# EAGLE design balloon_sensor_board (EAGLE 7.7.0)
Assembly variants: POR

## Sheet 1 of 3: TITLE_TOC
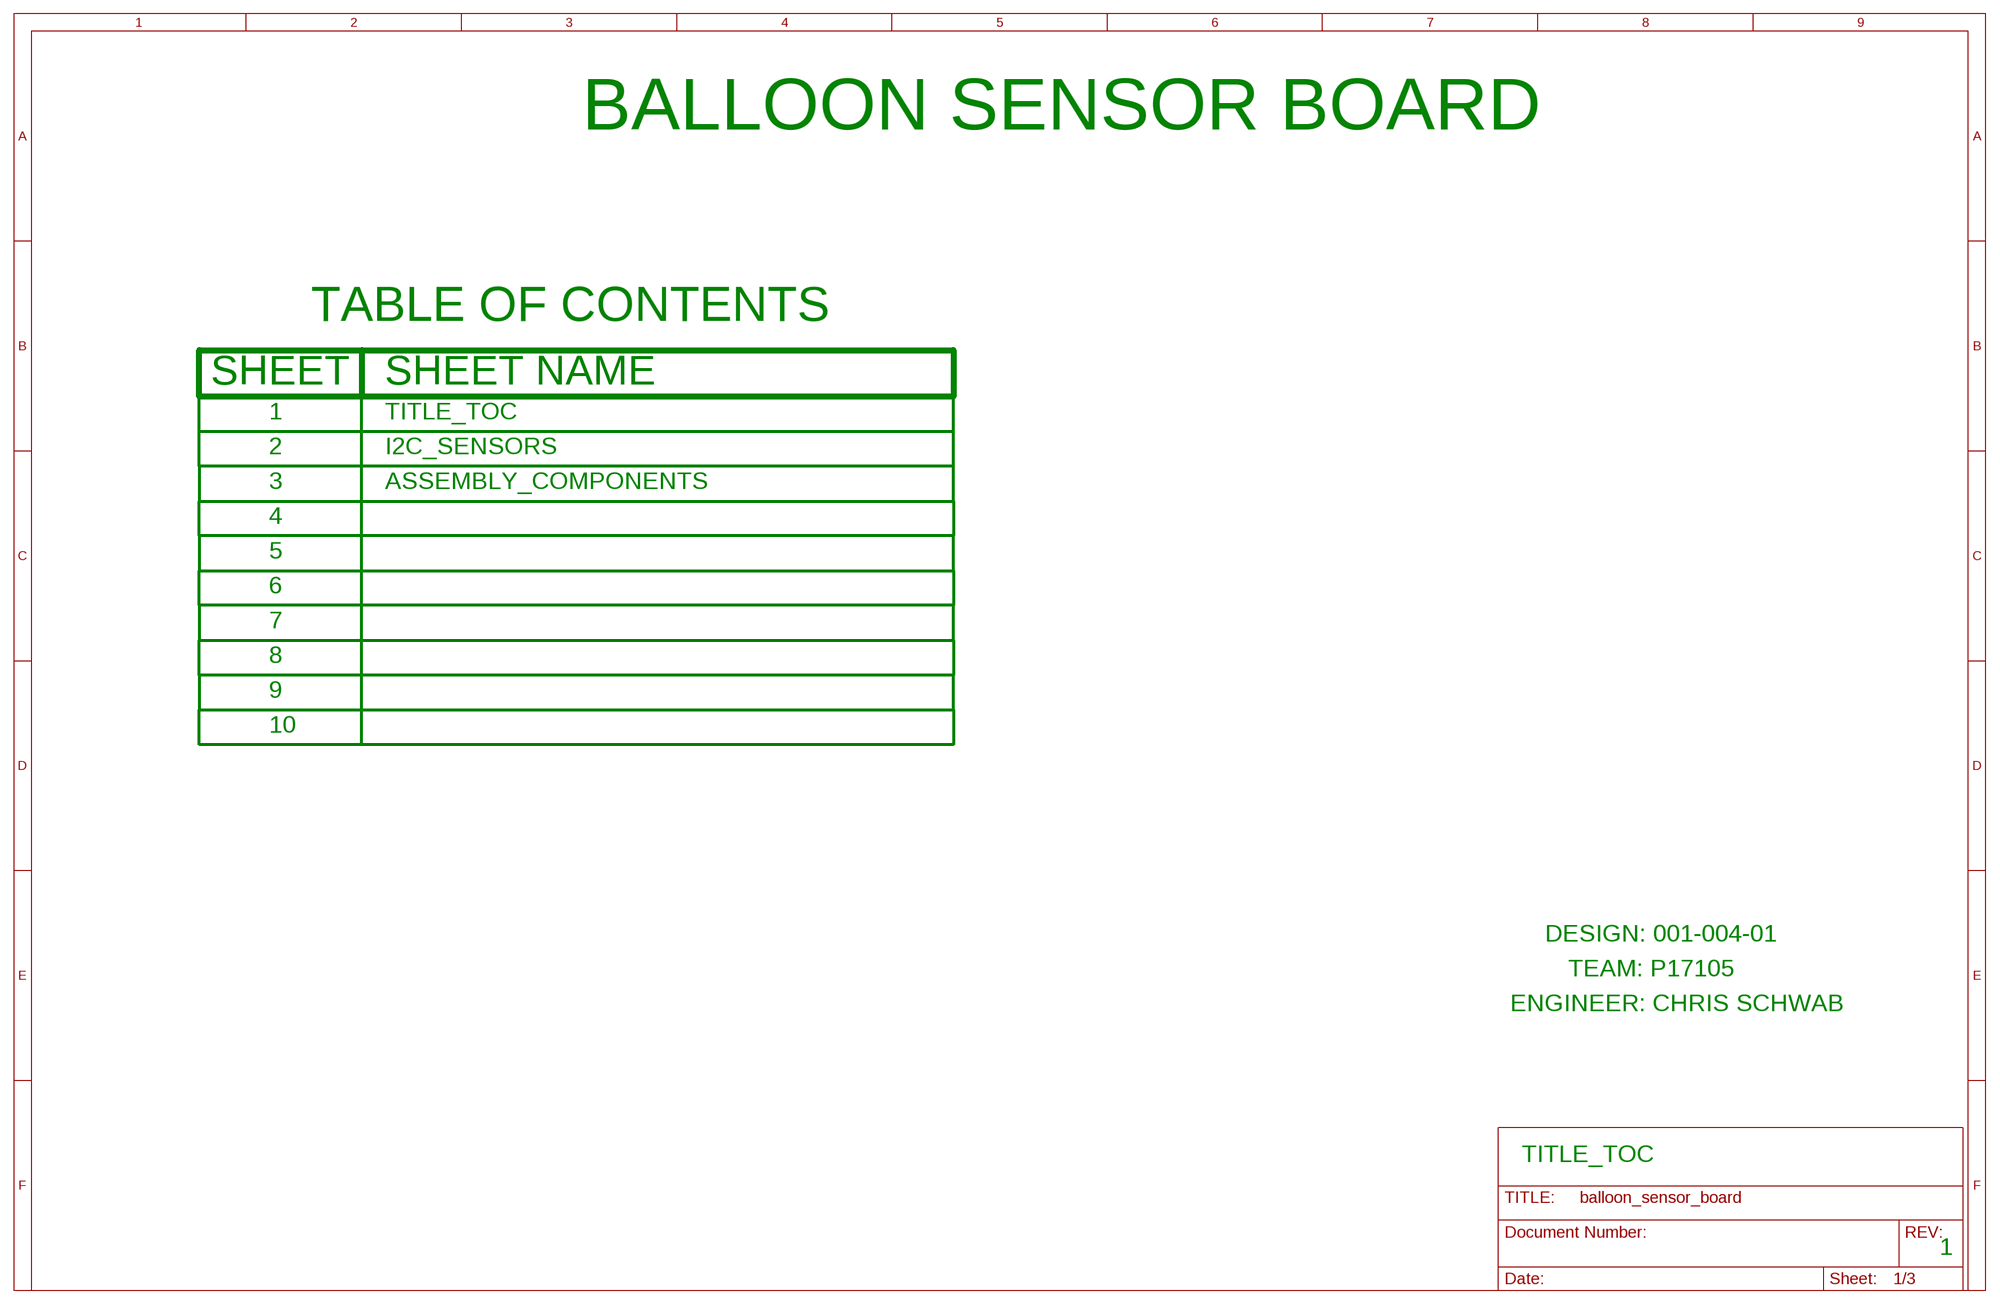
[diagram p0: schematic, sheet 1]

### Notes on the sheet
- BALLOON SENSOR BOARD
- TITLE_TOC
- I2C_SENSORS
- ASSEMBLY_COMPONENTS
- DESIGN: 001-004-01
- TEAM: P17105
- ENGINEER: CHRIS SCHWAB
- TITLE_TOC
- 1

## Sheet 2 of 3: I2C_SENSORS
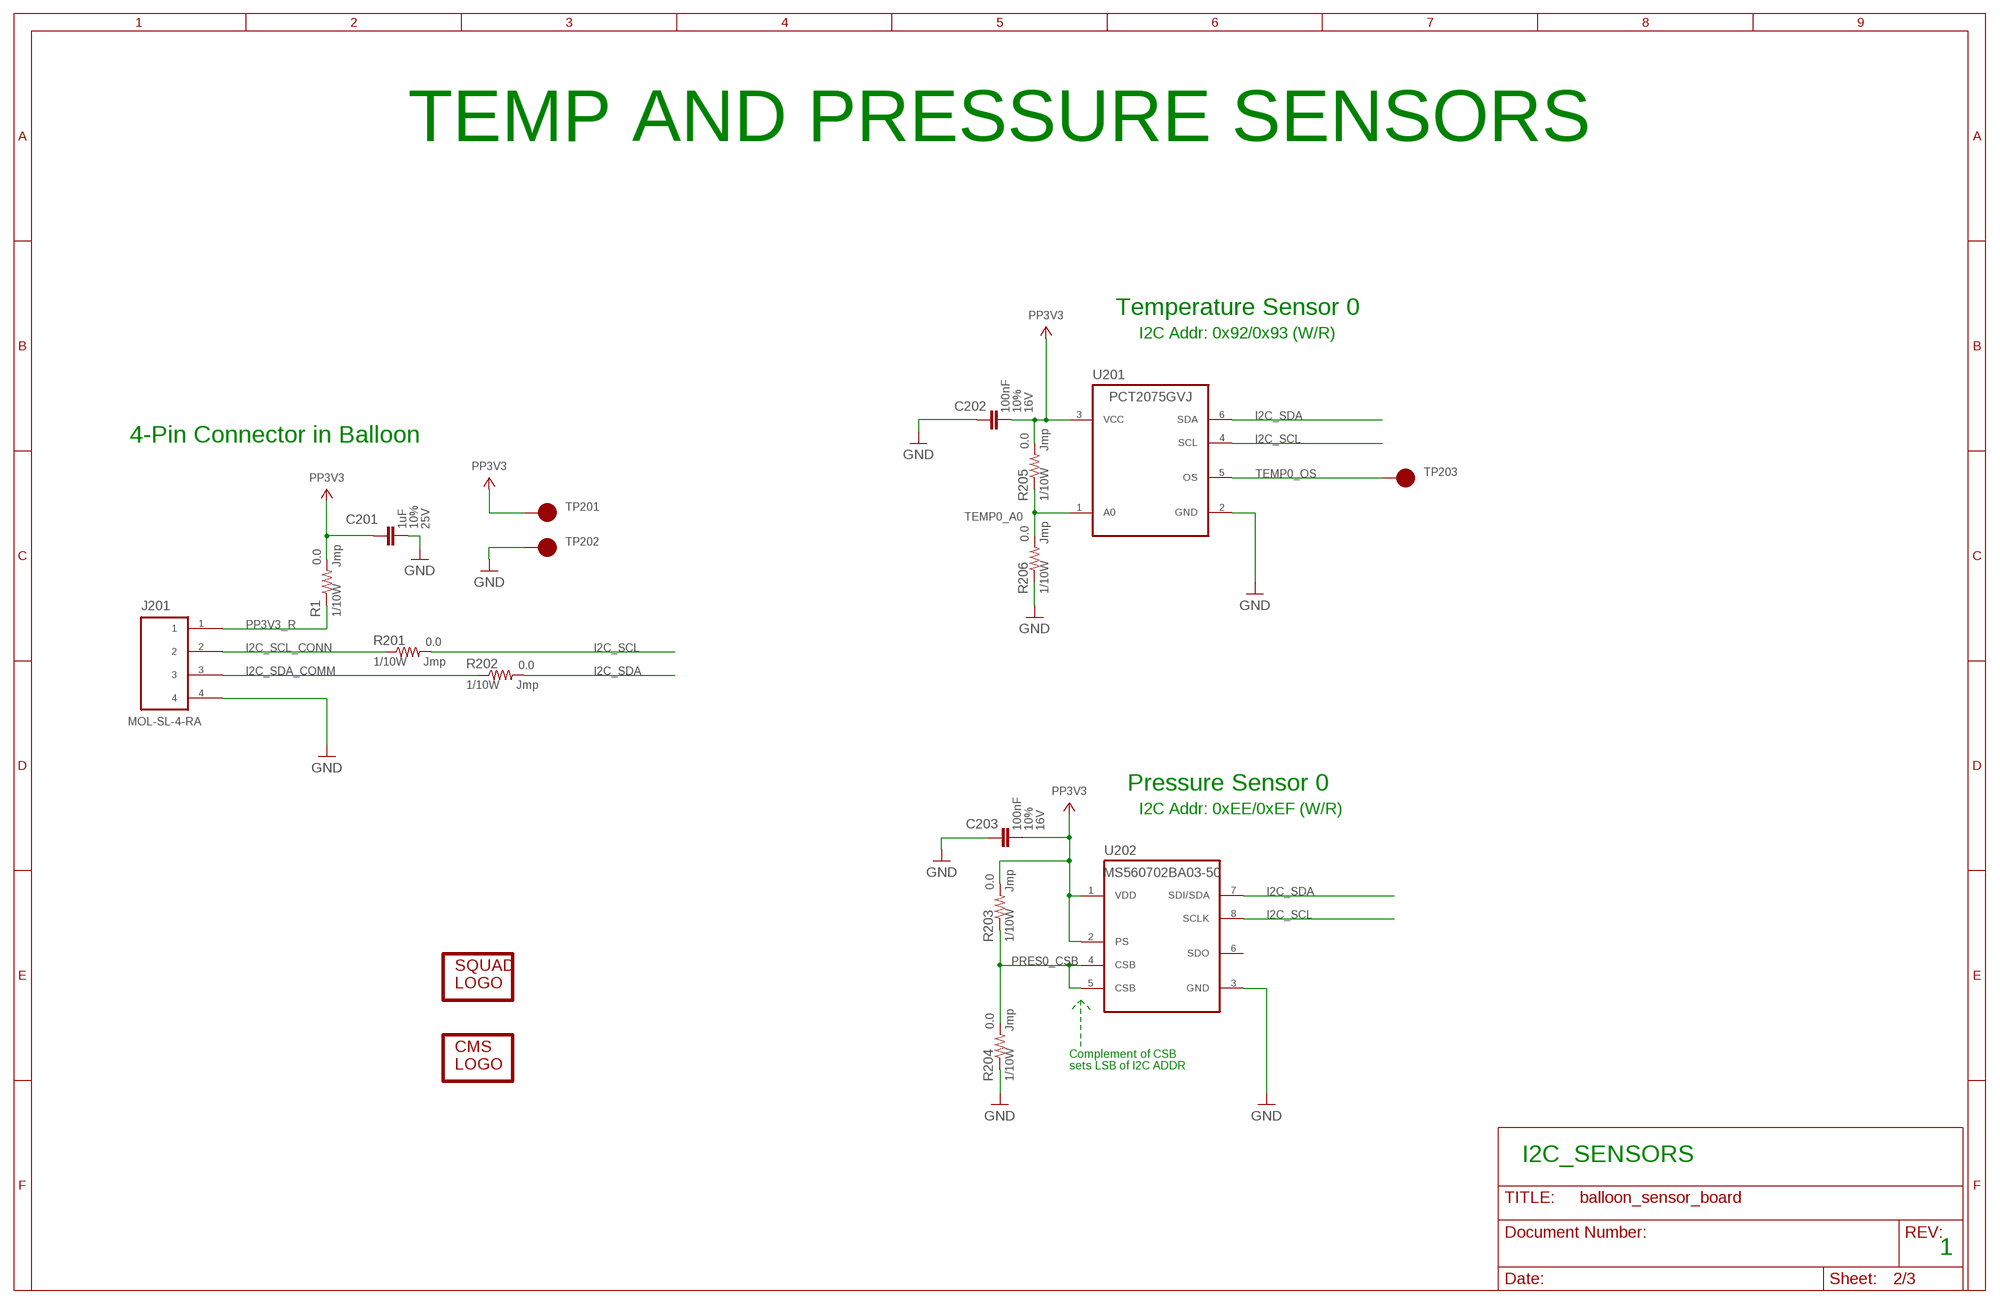
[diagram p1: schematic, sheet 2]

### Parts
C201  1uF  CAP_1UF0_0603  [C0603]
C202  100nF  CAP_100NF0_0603  [C0603]
C203  100nF  CAP_100NF0_0603  [C0603]
J201  MOL-SL-4-RA  MOLSL_4PIN_SL4RA_RA  [MOLSL-4-RA]
LOGO201  SQUAD_LOGO  [SQUAD_LOGO]
LOGO202  CMS_LOGO  [CMS_LOGO]
R1  0.0  RES_0R0_0603  [R0603]
R201  0.0  RES_0R0_0603  [R0603]
R202  0.0  RES_0R0_0603  [R0603]
R203  0.0  RES_0R0_0603  [R0603]  (not fitted in variant POR)
R204  0.0  RES_0R0_0603  [R0603]
R205  0.0  RES_0R0_0603  [R0603]  (not fitted in variant POR)
R206  0.0  RES_0R0_0603  [R0603]
TP201  TEST_POINT_SMT_15R_SMD  [TP15R]
TP202  TEST_POINT_SMT_15R_SMD  [TP15R]
TP203  TEST_POINT_SMT_15R_SMD  [TP15R]
U201  PCT2075GVJ  PCT2075GV_TSOP6  [TSOP95P080X055-6N]
U202  MS560702BA03-50  MS5607-02BA03_8SMD  [SMD125P110X060-8N]

### Nets
GND: C201.2 C202.1 C203.1 J201.4 R204.1 R206.1 TP202.TP U201.2(GND) U202.3(GND)
I2C_SCL: R201.2 U201.4(SCL) U202.8(SCLK)
I2C_SCL_CONN: J201.2 R201.1
I2C_SDA: R202.2 U201.6(SDA) U202.7(SDI/SDA)
I2C_SDA_COMM: J201.3 R202.1
PP3V3: C201.1 C202.2 C203.2 R1.2 R203.2 R205.2 TP201.TP U201.3(VCC) U202.1(VDD) U202.2(PS)
PP3V3_R: J201.1 R1.1
PRES0_CSB: R203.1 R204.2 U202.4(CSB) U202.5(CSB)
TEMP0_A0: R205.1 R206.2 U201.1(A0)
TEMP0_OS: TP203.TP U201.5(OS)
Unconnected: U202.6(SDO)

### Notes on the sheet
- TEMP AND PRESSURE SENSORS
- Temperature Sensor 0
- I2C Addr: 0x92/0x93 (W/R)
- 4-Pin Connector in Balloon
- Pressure Sensor 0
- I2C Addr: 0xEE/0xEF (W/R)
- Complement of CSB
- sets LSB of I2C ADDR
- I2C_SENSORS
- 1

## Sheet 3 of 3: ASSEMBLY_COMPONENTS
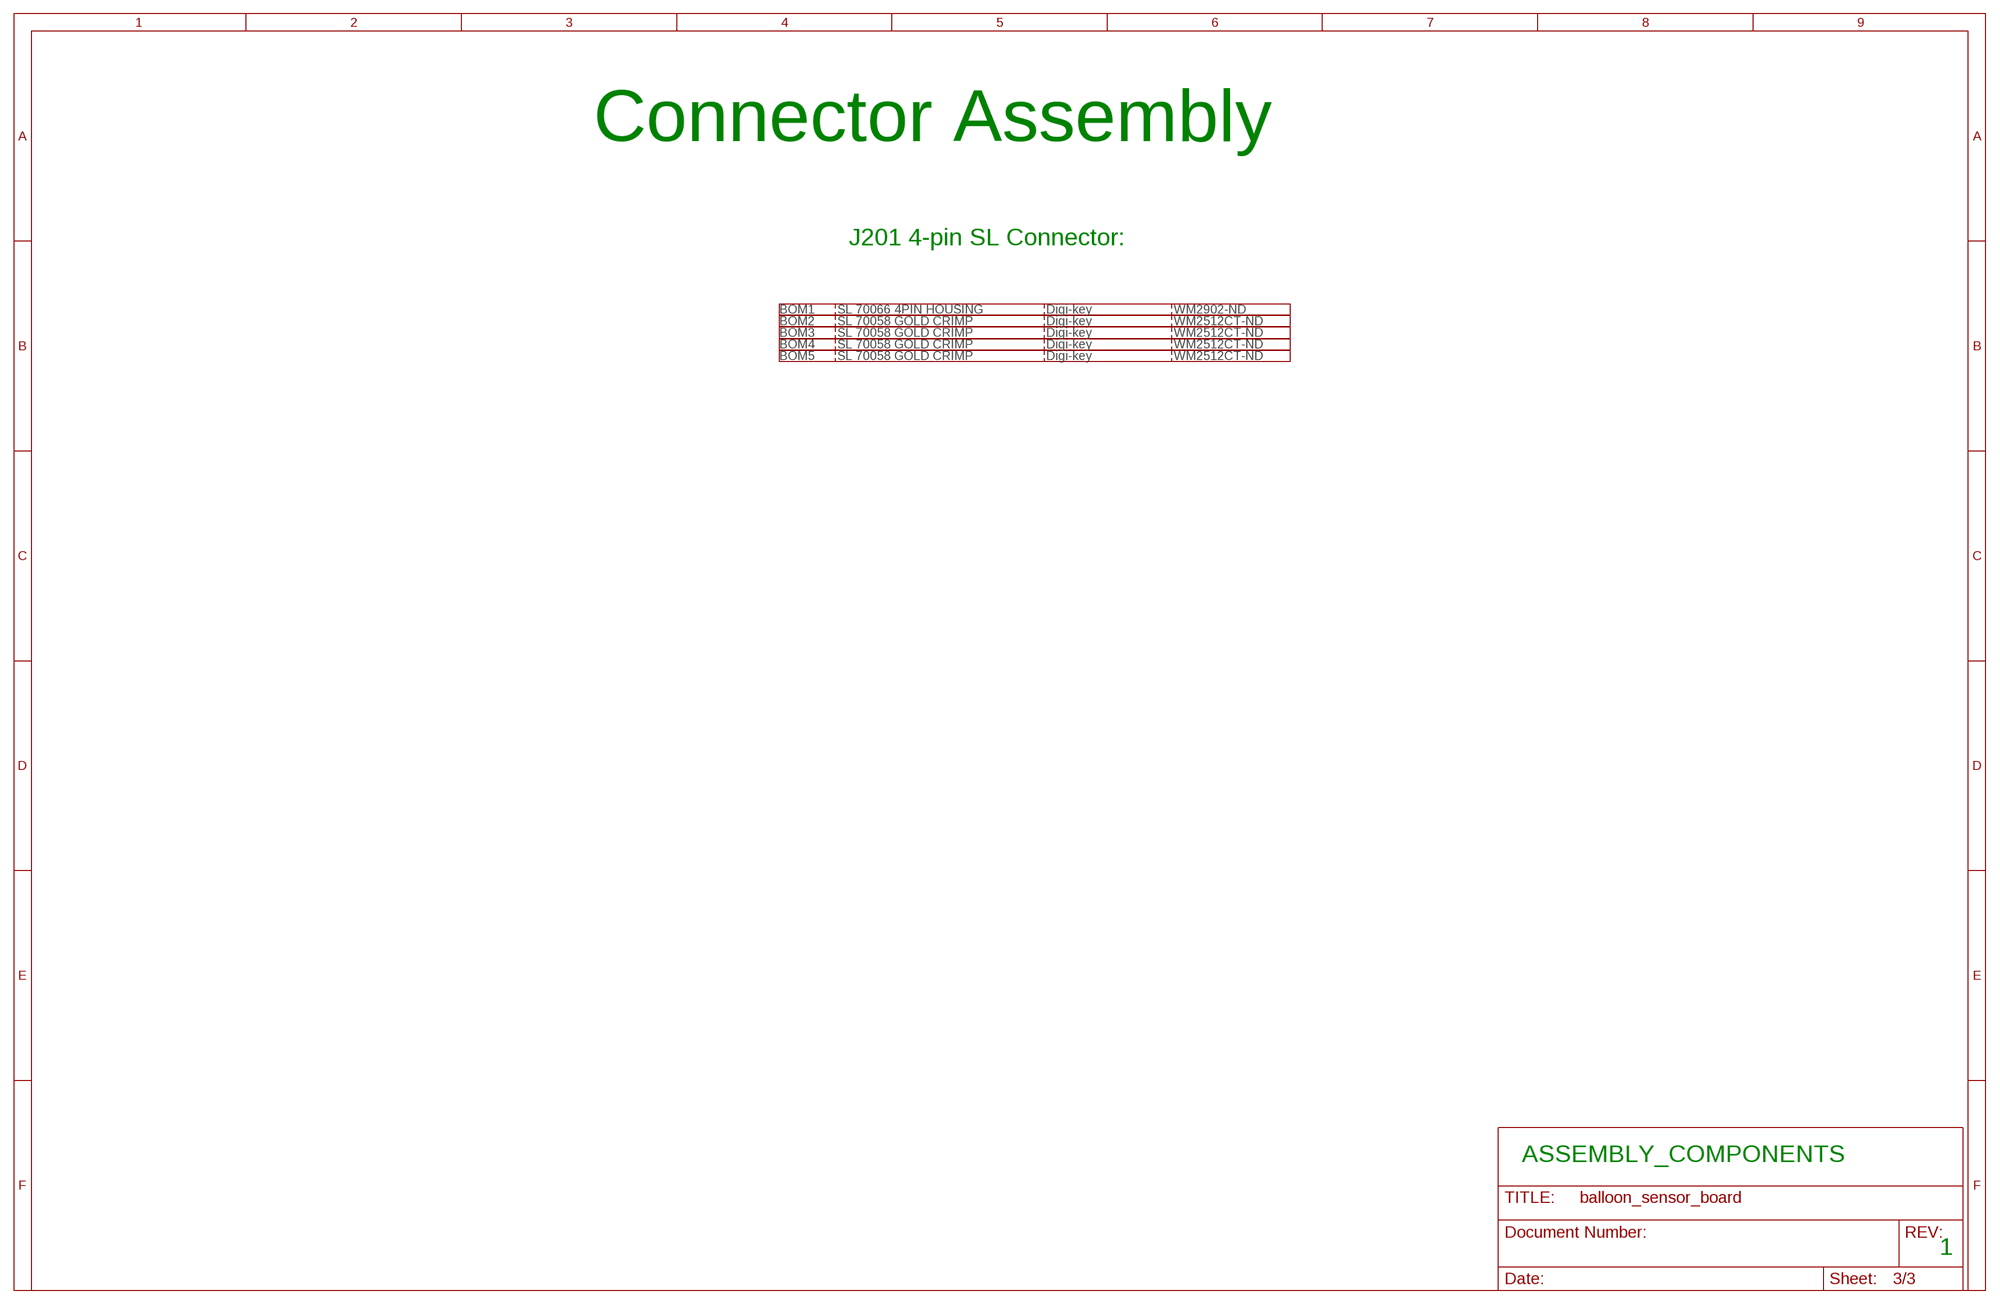
[diagram p2: schematic, sheet 3]

### Parts
BOM1  SL 70066 4PIN HOUSING  BOM_LINE_ITEM_BLI4  [BLANK]
BOM2  SL 70058 GOLD CRIMP  BOM_LINE_ITEM_BLI6  [BLANK]
BOM3  SL 70058 GOLD CRIMP  BOM_LINE_ITEM_BLI6  [BLANK]
BOM4  SL 70058 GOLD CRIMP  BOM_LINE_ITEM_BLI6  [BLANK]
BOM5  SL 70058 GOLD CRIMP  BOM_LINE_ITEM_BLI6  [BLANK]

### Notes on the sheet
- Connector Assembly
- J201 4-pin SL Connector:
- ASSEMBLY_COMPONENTS
- 1

## Library data of the parts
BOM1 = daqcs:BOM_LINE_ITEM; DATASHEET: HW/docs/projects/raspi_zero_power_sensor_hat/datasheets/connectors/uart_1wire_power_battery/050579402_sd.pdf; MANUFACTURER: Molex; MANUFACTURER_PN: 0050579404; VENDOR: Digi-key; VENDOR_PN: WM2902-ND
BOM2-BOM5 = daqcs:BOM_LINE_ITEM; DATASHEET: HW/docs/projects/raspi_zero_power_sensor_hat/datasheets/connectors/uart_1wire_power_battery/016020087_sd.pdf; MANUFACTURER: Molex; MANUFACTURER_PN: 0016020087; VENDOR: Digi-key; VENDOR_PN: WM2512CT-ND
C201 = daqcs:CAP: Chip Capacitor; DATASHEET: HW/docs/projects/raspi_zero_power_sensor_hat/datasheets/passives/c02e.pdf; MANUFACTURER: Murata; MANUFACTURER_PN: GRM188R61E105KA12D; TEMP_COEFF: X5R; TOLERANCE: 10%; VENDOR: Digi-key; VENDOR_PN: 490-3897-1-ND; VOLTAGE: 25V
C202 C203 = daqcs:CAP: Chip Capacitor; DATASHEET: HW/docs/projects/raspi_zero_power_sensor_hat/datasheets/passives/c02e.pdf; MANUFACTURER: Murata; MANUFACTURER_PN: GRM188R71C104KA01D; TEMP_COEFF: X7R; TOLERANCE: 10%; VENDOR: Digi-key; VENDOR_PN: 490-1532-1-ND; VOLTAGE: 16V
J201 = daqcs:MOLSL_4PIN: Molex SL Series 4-Position Connector Wire to board 2.54 mm (.1 inch) pitch header (right-angle or vertical) Housing: Vendor=Molex, Vendor_PN=0050579404 22-24 AWG Crimp: Vendor=Molex, Vendor_PN=0016020087 Wires: AWG,Amps (Max) 22, 3.0 24, 3.0 26, 1.8 28, 1.2; DATASHEET: HW/docs/projects/raspi_zero_power_sensor_hat/datasheets/connectors/uart_1wire_power_battery/705530001_sd.pdf; FINISH: GOLD; LOCKING: YES; MANUFACTURER: Molex; MANUFACTURER_PN: 0705530003; MAX_CURRENT: 3.0A; MOUNT_ANGLE: RIGHT; MOUNT_TYPE: TH; POSITIONS: 4; VENDOR: Digi-key; VENDOR_PN: WM4902-ND
LOGO201 = daqcs:SQUAD_LOGO
LOGO202 = daqcs:CMS_LOGO
R1 R201-R206 = daqcs:RES: Chip Resistor; DATASHEET: HW/docs/projects/raspi_zero_power_sensor_hat/datasheets/passives/AOA0000C281.pdf; MANUFACTURER: Panasonic; MANUFACTURER_PN: ERJ-3GEY0R00V; POWER: 1/10W; RATED_CURRENT: 1.0A; TOLERANCE: Jmp; VENDOR: Digi-key; VENDOR_PN: P0.0GCT-ND
TP201-TP203 = daqcs:TEST_POINT_SMT: Test Point (various sizes)
U201 = daqcs:PCT2075GV: I2C-bus Fm+, 1 degree C accuracy, digital temperature sensor and thermal watchdog; DATASHEET: HW/docs/projects/raspi_zero_power_sensor_hat/datasheets/sensors/PCT2075.pdf; INTERFACE: I2C; MANUFACTURER: NXP; MANUFACTURER_PN: PCT2075GVJ; RESOLUTION: 10b; VENDOR: Digi-key; VENDOR_PN: 568-12424-1-ND
U202 = daqcs:MS5607: Barometric Pressure Sensor, with stainless steel cap Specs High resolution module, 20cm Fast conversion down to 1 ms Low power, 1 μA (standby < 0.15 μA) QFN package 5.0 x 3.0 x 1.0 mm3 Supply voltage 1.8 to 3.6 V Integrated digital pressure sensor (24 bit ΔΣ ADC) Operating range: 10 to 1200 mbar, -40 to +85 °C I2C and SPI interface up to 20 MHz No external components (Internal oscillator) Excellent long term stability; DATASHEET: HW/docs/projects/raspi_zero_power_sensor_hat/datasheets/sensors/ENG_DS_MS5607-02BA03_B.pdf; INTERFACE: I2C,SPI; MANUFACTURER: TE Connectivity; MANUFACTURER_PN: MS560702BA03-50; OUTPUT_BITS: 24b; PRESSURE_TYPE: Absolute; VENDOR: Digi-key; VENDOR_PN: 223-1198-1-ND

## Net classes
0 default: drill 0.381 mm, clearance 0.152 mm

## Board
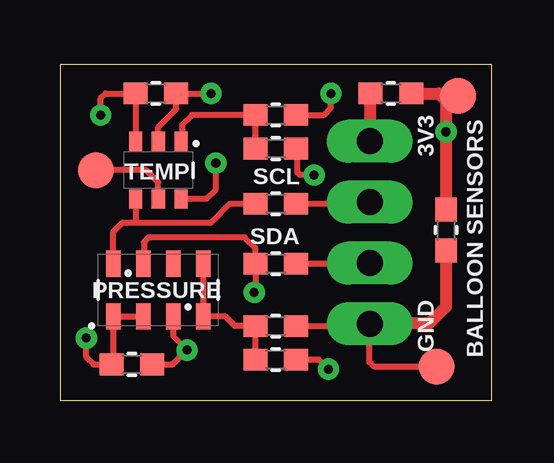
[diagram p3: board, top side]
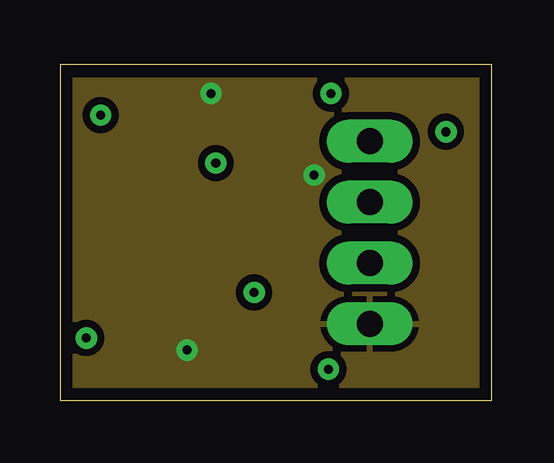
[diagram p4: board, inner layer GND]
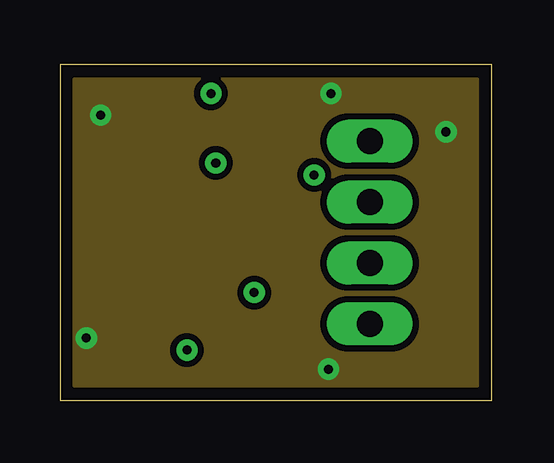
[diagram p5: board, inner layer PWR]
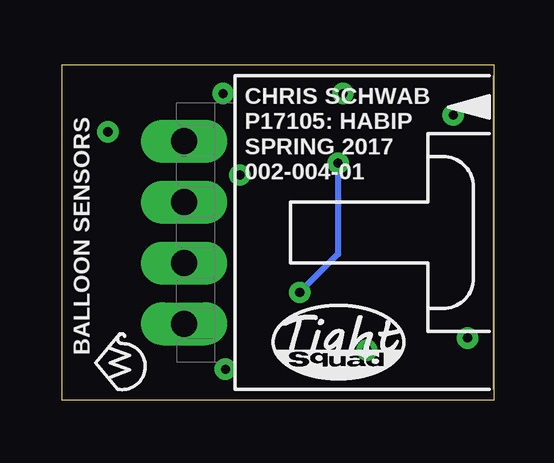
[diagram p6: board, bottom side, seen from below]

Size 18 x 14 mm. Coordinates in mm from the lower left corner, seen from the top.
Outline: 0,0 18,0 18,14 0,14 0,0
Copper layers (1+2*15+16): Top 0.035mm / dielectric 0.486mm / GND 0.035mm / dielectric 0.488mm / PWR 0.035mm / dielectric 0.486mm / Bottom 0.035mm
Design rules "4layer_4pcb": minimum track width 6mil, minimum drill 15mil, track to track 6mil, track to pad 6mil, pad to pad 6mil, via to via 6mil, smd to smd 6mil, copper to edge 20mil, drill to drill 10mil, minimum pad ring 14mil, minimum via ring 10mil, stop-mask expansion 2.5mil, vias tented up to drill 16mil, thermal gap 10mil

### Footprints (pad centres in the part's own frame; a part is rotated, then mirrored left to right if it is on the bottom)
C0603 = smd 1 x 0.9: 1 -0.85,0; 2 0.85,0
MOLSL-4-RA = drill 1.09 long: 1 -3.81,-7.62; 2 -1.27,-7.62; 3 1.27,-7.62; 4 3.81,-7.62
R0603 = smd 1 x 0.9: 1 -0.85,0; 2 0.85,0
TP15R = smd 1.5 x 1.5: TP 0,0
TSOP95P080X055-6N = smd 0.8 x 0.55: 1 -1.2,0.95; 2 -1.2,0; 3 -1.2,-0.95; 4 1.2,-0.95; 5 1.2,0; 6 1.2,0.95
SMD125P110X060-8N = smd 1.1 x 0.6: 1 -1.1,1.875; 2 -1.1,0.625; 3 -1.1,-0.625; 4 -1.1,-1.875; 5 1.1,-1.875; 6 1.1,-0.625; 7 1.1,0.625; 8 1.1,1.875

### Placement (x,y rotation side)
BOM1  18.8,13.7 0 top
BOM2  18.9,12.7 0 top
BOM3  19,12 0 top
BOM4  19.1,11.3 0 top
BOM5  19.2,10.6 0 top
C201  16.1,7.1 270 top
C202  4,12.8 180 top
C203  3,1.5 180 top
J201  5.3,7 270 bottom
LOGO201  9.3,0.8 0 bottom
LOGO202  16.3,0.7 0 bottom
R1  13.8,12.8 0 top
R201  9,8.2 180 top
R202  9,5.7 180 top
R203  9,1.7 0 top
R204  9,3.1 180 top
R205  9,11.9 0 top
R206  9,10.5 180 top
TP201  16.6,12.7 0 top
TP202  15.7,1.4 0 top
TP203  1.5,9.6 0 top
U201  4.1,9.6 270 top
U202  4.1,4.6 90 top

### Tracks (layer width: path | path; a pad name or v marks a point on that pad's centre or on a via)
GND  (via drill 0.38)
  Top 0.254: 4.7,3.48 U202.3 4.72,2.67 v5.3,2.1 4.7,1.5 C203.1 | R204.1 12.83,3.1 J201.4 12.9,3.17 12.9,1.6 13.1,1.4 TP202.TP | U201.2 4.1,11.4 4.85,12.15 C202.1 v6.3,12.8 | v10.6,9.4 10,9.4 9.9,9.5 9.9,10.45 R206.1
  Top 0.5: C201.2 16.1,3.9 15.4,3.2 J201.4
  pour GND (isolate 0.305): 0.6,13.4 0.6,0.6 17.4,0.6 17.4,13.4
I2C_SCL
  Top 0.254: 3.2,7.4 6.3,7.4 7.1,8.2 R201.2 | 3.2,7.4 2.6,7.4 2.2,7 2.2,5.72 U202.8 | U201.4 3.15,7.45 3.2,7.4
I2C_SCL_CONN
  Top 0.254: R201.1 12.85,8.2 J201.2
I2C_SDA  (via drill 0.38)
  Top 0.254: U202.7 3.5,5.72 3.5,6.6 3.7,6.8 7.7,6.8 8.15,6.35 R202.2 8.15,4.55 v8.1,4.5 | U201.6 6.1,8.4 6.5,8.8 v6.5,9.9
  Bottom 0.254: v6.5,9.9 6.5,6.1 v8.1,4.5
I2C_SDA_COMM
  Top 0.254: R202.1 12.89,5.7 J201.3
PP3V3  (via drill 0.38)
  Top 0.254: v1.1,2.6 1.1,1.8 1.4,1.5 C203.2 2.23,1.57 U202.1 U202.2 | U201.3 C202.2 1.9,12.8 1.7,12.6 v1.7,11.9 | R205.2 11,11.9 11.3,12.2 v11.3,12.8 | R203.2 10.8,1.7 v11.2,1.3 | TP201.TP 16.4,12.8 16.1,12.5
  Top 0.5: C201.1 v16.1,11.2 16.1,12.5 15.8,12.8 R1.2
  pour PWR (isolate 0.254): 0.6,13.4 0.6,0.6 17.4,0.6 17.4,13.4
PP3V3_R
  Top 0.5: J201.1 12.95,10.84 R1.1
PRES0_CSB
  Top 0.254: R203.1 R204.2 7.3,3.1 6.9,3.5 U202.4 U202.5
TEMP0_A0
  Top 0.254: U201.1 5.1,10.85 5.1,11.5 5.5,11.9 R205.1 R206.2
TEMP0_OS
  Top 0.254: U201.5 4.1,9.1 3.6,9.6 TP203.TP

### Text on the board
tPlace: 3V3 | BALLOON SENSORS | TEMP | SCL | SDA | PRESSURE | GND
bPlace: BALLOON SENSORS | CHRIS SCHWAB / P17105: HABIP / SPRING 2017 / 002-004-01